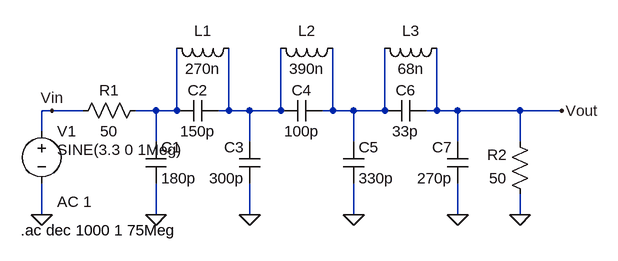
[diagram p0: schematic 滤波链路.asc]
滤波链路.asc, the LTspice schematic file:
Version 4.1
SHEET 1 880 680
WIRE -192 144 -208 144
WIRE -144 144 -192 144
WIRE -32 144 -64 144
WIRE 0 144 0 48
WIRE 0 144 -32 144
WIRE 80 144 80 48
WIRE 80 144 64 144
WIRE 112 144 80 144
WIRE 160 144 160 48
WIRE 160 144 112 144
WIRE 240 144 240 48
WIRE 240 144 224 144
WIRE 272 144 240 144
WIRE 320 144 320 48
WIRE 320 144 272 144
WIRE 400 144 400 48
WIRE 400 144 384 144
WIRE 432 144 400 144
WIRE 528 144 432 144
WIRE 592 144 528 144
WIRE -208 176 -208 144
WIRE -32 192 -32 144
WIRE 112 192 112 144
WIRE 272 192 272 144
WIRE 432 192 432 144
WIRE 528 192 528 144
WIRE -208 304 -208 256
WIRE -32 304 -32 256
WIRE 112 304 112 256
WIRE 272 304 272 256
WIRE 432 304 432 256
WIRE 528 304 528 272
FLAG -32 304 0
FLAG 112 304 0
FLAG 272 304 0
FLAG 432 304 0
FLAG 528 304 0
FLAG 592 144 Vout
FLAG -192 144 Vin
FLAG -208 304 0
SYMBOL res -48 128 R90
WINDOW 0 0 56 VBottom 2
WINDOW 3 32 56 VTop 2
SYMATTR InstName R1
SYMATTR Value 50
SYMBOL res 544 288 R180
WINDOW 0 36 76 Left 2
WINDOW 3 36 40 Left 2
SYMATTR InstName R2
SYMATTR Value 50
SYMBOL cap -48 256 M180
WINDOW 0 24 56 Left 2
WINDOW 3 24 8 Left 2
SYMATTR InstName C1
SYMATTR Value 180p
SYMBOL cap 64 160 M270
WINDOW 0 32 32 VTop 2
WINDOW 3 0 32 VBottom 2
SYMATTR InstName C2
SYMATTR Value 150p
SYMBOL cap 128 192 M0
SYMATTR InstName C3
SYMATTR Value 300p
SYMBOL cap 160 128 M90
WINDOW 0 0 32 VBottom 2
WINDOW 3 32 32 VTop 2
SYMATTR InstName C4
SYMATTR Value 100p
SYMBOL cap 256 256 M180
WINDOW 0 24 56 Left 2
WINDOW 3 24 8 Left 2
SYMATTR InstName C5
SYMATTR Value 330p
SYMBOL cap 384 160 M270
WINDOW 0 32 32 VTop 2
WINDOW 3 0 32 VBottom 2
SYMATTR InstName C6
SYMATTR Value 33p
SYMBOL cap 448 192 M0
SYMATTR InstName C7
SYMATTR Value 270p
SYMBOL ind 96 32 R90
WINDOW 0 5 56 VBottom 2
WINDOW 3 32 56 VTop 2
SYMATTR InstName L1
SYMATTR Value 270n
SYMATTR SpiceLine Rser=1m
SYMBOL ind 256 32 R90
WINDOW 0 5 56 VBottom 2
WINDOW 3 32 56 VTop 2
SYMATTR InstName L2
SYMATTR Value 390n
SYMATTR SpiceLine Rser=1m
SYMBOL ind 416 32 R90
WINDOW 0 5 56 VBottom 2
WINDOW 3 32 56 VTop 2
SYMATTR InstName L3
SYMATTR Value 68n
SYMATTR SpiceLine Rser=1m
SYMBOL voltage -208 160 R0
WINDOW 123 24 124 Left 2
WINDOW 39 0 0 Left 0
WINDOW 3 24 44 Left 2
SYMATTR Value2 AC 1
SYMATTR InstName V1
SYMATTR Value SINE(3.3 0 1Meg)
TEXT -240 328 Left 2 !.ac dec 1000 1 75Meg

The netlist it stands for:
* 滤波链路.asc
R1 N001 Vin 50
R2 0 Vout 50
C1 0 N001 180p
C2 N002 N001 150p
C3 N002 0 300p
C4 N002 N003 100p
C5 0 N003 330p
C6 Vout N003 33p
C7 Vout 0 270p
L1 N002 N001 270n Rser=1m
L2 N003 N002 390n Rser=1m
L3 Vout N003 68n Rser=1m
V1 Vin 0 SINE(3.3 0 1Meg) AC 1
.ac dec 1000 1 75Meg
.backanno
.end